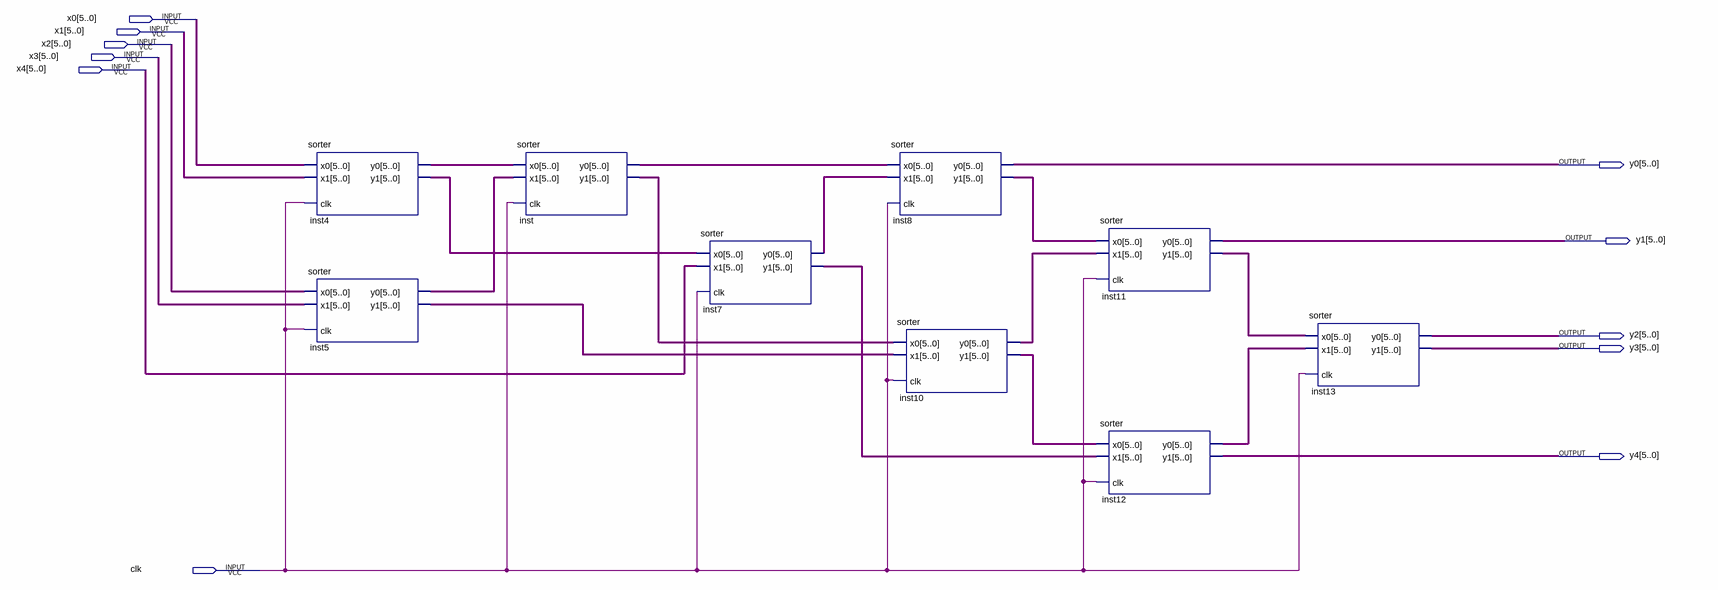
[diagram p0: schematic sheet]
// Quartus schematic bitonic_sorter.bdf as structural Verilog: 9 symbols, 11 pins
module bitonic_sorter (
  input  [5:0] x0,
  input  [5:0] x1,
  input  [5:0] x2,
  input  [5:0] x3,
  input  [5:0] x4,
  input  clk,
  output [5:0] y0,
  output [5:0] y1,
  output [5:0] y2,
  output [5:0] y3,
  output [5:0] y4
);

  wire [5:0] inst4_y0, inst4_y1, inst5_y0, inst5_y1, inst7_y0, inst7_y1, inst8_y1, inst10_y0, inst10_y1,
       inst11_y1, inst12_y0, inst_y0, inst_y1;

  sorter inst4 (.clk(clk), .x0(x0), .x1(x1), .y0(inst4_y0), .y1(inst4_y1));
  sorter inst5 (.clk(clk), .x0(x2), .x1(x3), .y0(inst5_y0), .y1(inst5_y1));
  sorter inst (.clk(clk), .x0(inst4_y0), .x1(inst5_y0), .y0(inst_y0), .y1(inst_y1));
  sorter inst7 (.clk(clk), .x0(inst4_y1), .x1(x4), .y0(inst7_y0), .y1(inst7_y1));
  sorter inst8 (.clk(clk), .x0(inst_y0), .x1(inst7_y0), .y0(y0), .y1(inst8_y1));
  sorter inst10 (.clk(clk), .x0(inst_y1), .x1(inst5_y1), .y0(inst10_y0), .y1(inst10_y1));
  sorter inst11 (.clk(clk), .x0(inst8_y1), .x1(inst10_y0), .y0(y1), .y1(inst11_y1));
  sorter inst12 (.clk(clk), .x0(inst10_y1), .x1(inst7_y1), .y0(inst12_y0), .y1(y4));
  sorter inst13 (.clk(clk), .x0(inst11_y1), .x1(inst12_y0), .y0(y2), .y1(y3));
endmodule
